# Altium schematic sheet Sheet1.SchDoc
size A
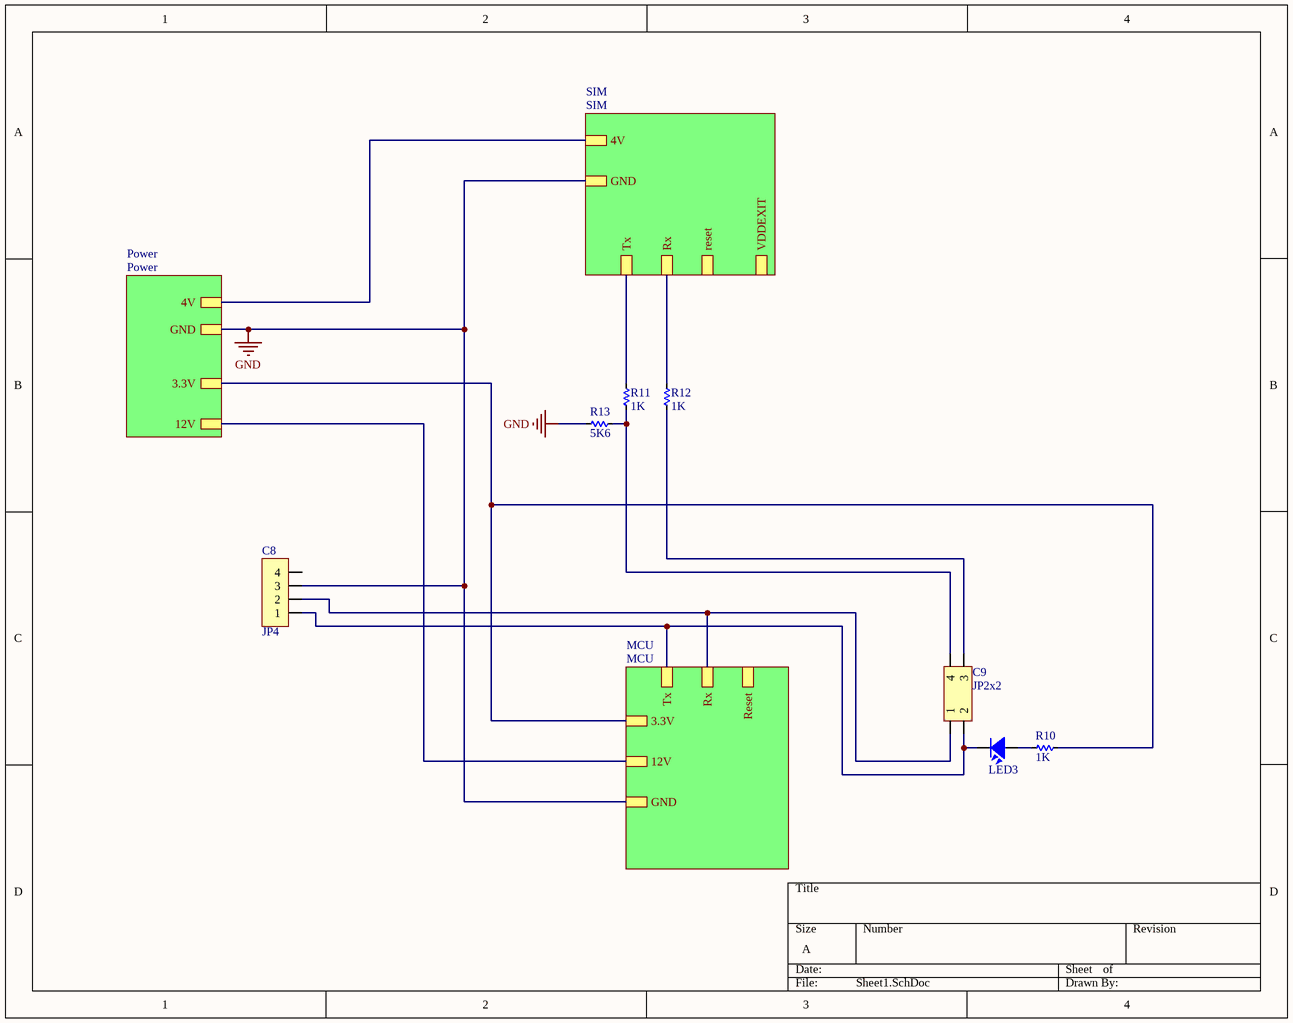
[diagram p0: Sheet1.SchDoc]

## Parts
C8  JP4  [JP4-C1T]
C9  JP2x2  [JP2-D2T]
LED3  LED  [LED-0805-Green]  (value not drawn)
R10  1K  [RES-SMD-0805]
R11  1K  [RES-SMD-0805]
R12  1K  [RES-SMD-0805]
R13  5K6  [RES-SMD-0805]

## Sub-sheets
MCU = MCU: 3.3V, GND, Tx, Rx, Reset, 12V
Power = Power: 4V, GND, 3.3V, 12V
SIM = SIM: 4V, GND, Tx, Rx, reset, VDDEXIT

## Nets
GND: C8.3 R13.2 ; sheet Power/GND, sheet SIM/GND, sheet MCU/GND
NetC8_1: C8.1 C9.2 LED3.2 ; sheet MCU/Tx
NetC8_2: C8.2 C9.1 ; sheet MCU/Rx
NetC9_3: C9.3 R12.2
NetC9_4: C9.4 R11.2 R13.1
NetLED3_1: LED3.1 R10.1
NetR10_2: R10.2 ; sheet Power/3.3V, sheet MCU/3.3V
NetR11_1: R11.1 ; sheet SIM/Tx
NetR12_1: R12.1 ; sheet SIM/Rx
(unnamed): sheet Power/4V, sheet SIM/4V
(unnamed): sheet Power/12V, sheet MCU/12V

Not connected (* = marked no-connect by the designer): C8 4

## Library data of the parts
C8 = JP4: WR-PHD 2.54 mm Angled Socket Header; Manufacturer: W¨¹rth Elektronik eiSos GmbH; partNo: 613004143121; ComponentLink1 Description: Manufacturer; ComponentLink2 Description: Datasheet; NoPins: 04; Created Date: 29 March 2013; ComponentLink1URL: http://www.we-online.com; ComponentLink2URL: http://katalog.we-online.de/em/datasheet/6130xx143121.pdf; Created by: Karrer Zheng
C9 = JP2x2: WR-PHD 2.54 mm Dual Socket Header; Manufacturer: W¨¹rth Elektronik eiSos GmbH; partNo: 61300421821; ComponentLink1 Description: Manufacturer; ComponentLink2 Description: Datasheet; NoPins: 04; Created Date: 29 March 2013; ComponentLink1URL: http://www.we-online.com; ComponentLink2URL: http://katalog.we-online.de/em/datasheet/6130xx21821.pdf; Created by: Karrer Zheng
LED3 = LED SMD: Value: LED 3 - 5 ly 2 Colour
R10-R13 = Res-SMD: Resistor; Manufacturer: Generic Components; Class: Passive; Published: 08/06/2000; Publisher: Altium Hobart Technology Centre